# Altium project DRIVER POWER SUPPLY MODULE.PrjPcb
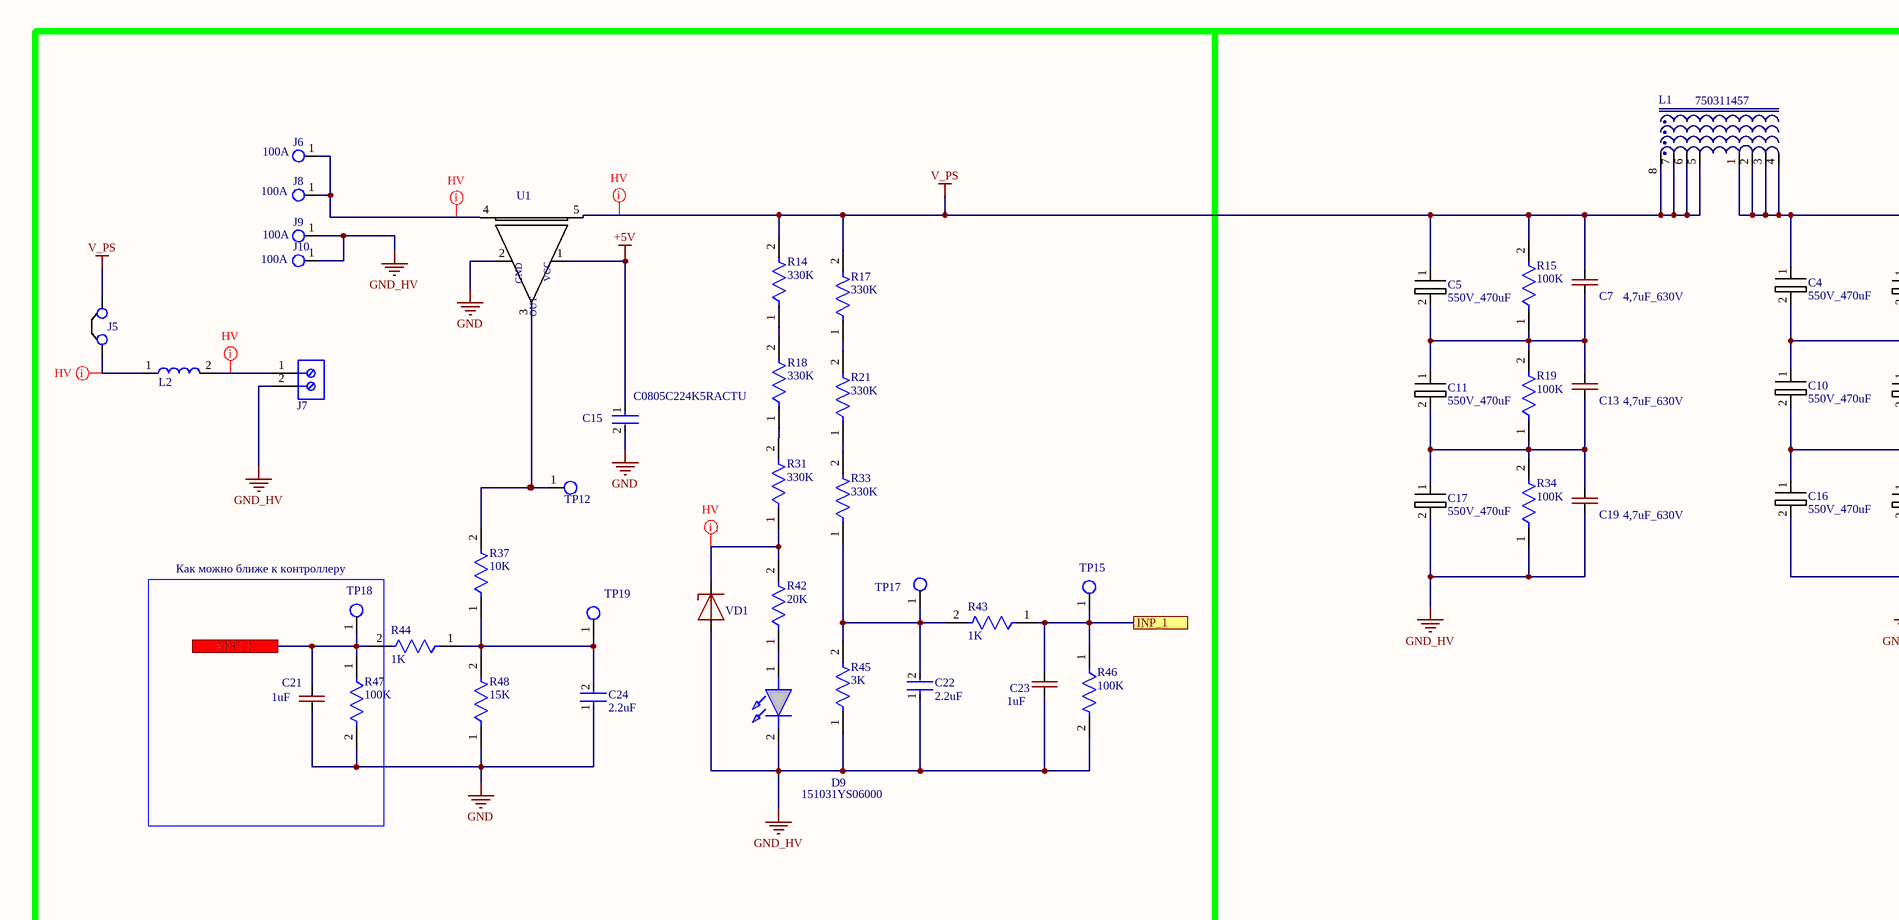
[diagram p0: DRIVER POWER SUPPLY MODULE.SchDoc, top left]
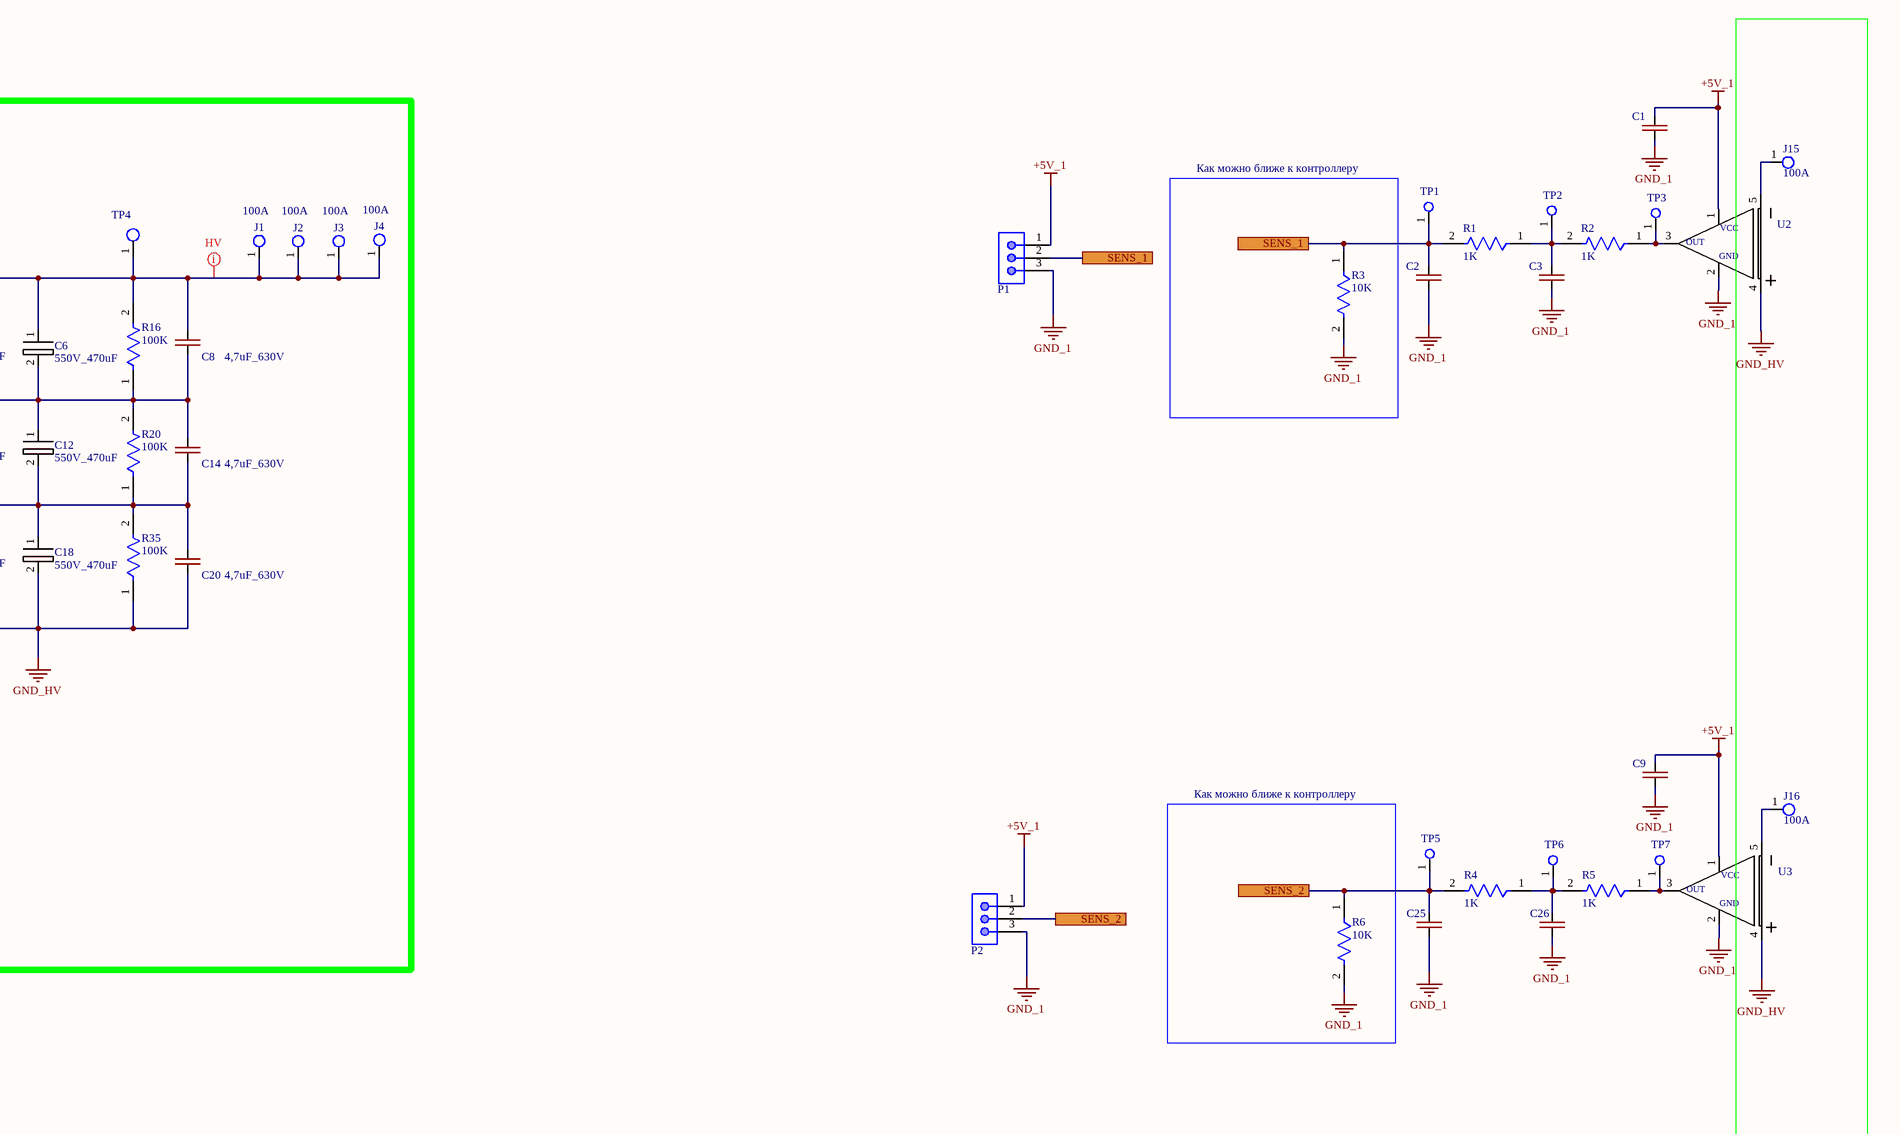
[diagram p1: DRIVER POWER SUPPLY MODULE.SchDoc, top right]
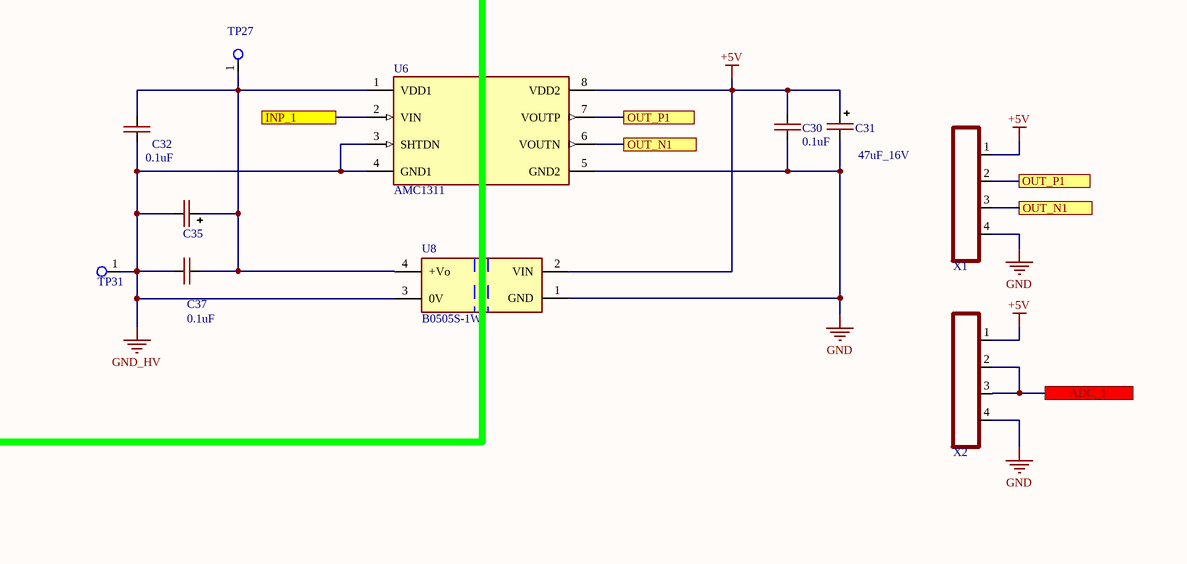
[diagram p2: DRIVER POWER SUPPLY MODULE.SchDoc, bottom left]
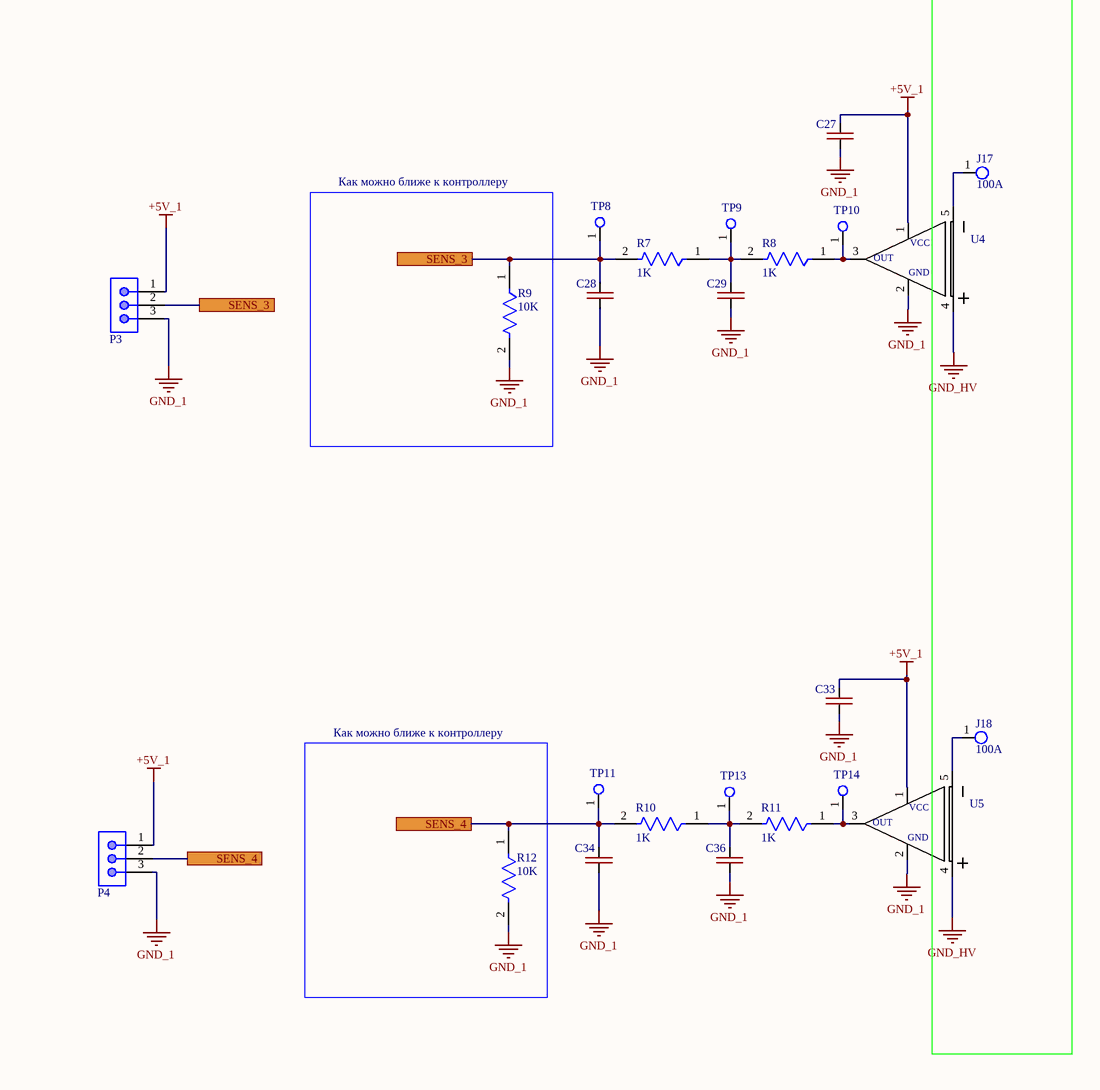
[diagram p3: DRIVER POWER SUPPLY MODULE.SchDoc, bottom right]
1 sheet, 120 parts. Net scope: flat (ports and power ports of the same name join across sheets).
Board file: DRIVER POWER SUPPLY MODULE.PcbDoc

## Sheet DRIVER POWER SUPPLY MODULE.SchDoc
size 1600 x 1200 mm; SheetNumber: 1; SheetTotal: 1; SPICEModelCacheBTRAQOWF: <root> / <DocumentId>BTRAQOWF</DocumentId> / </root>

### Parts
C1  CAP-NON-POLAR  [CAP-0805]  (value not drawn)
C2  CAP-NON-POLAR  [CAP-0805]  (value not drawn)
C3  CAP-NON-POLAR  [CAP-0805]  (value not drawn)
C4  550V_470uF  [500V_470uF]
C5  550V_470uF  [500V_470uF]
C6  550V_470uF  [500V_470uF]
C7  4,7uF_630V  [CAP_4.7uF_630V]
C8  4,7uF_630V  [CAP_4.7uF_630V]
C9  CAP-NON-POLAR  [CAP-0805]  (value not drawn)
C10  550V_470uF  [500V_470uF]
C11  550V_470uF  [500V_470uF]
C12  550V_470uF  [500V_470uF]
C13  4,7uF_630V  [CAP_4.7uF_630V]
C14  4,7uF_630V  [CAP_4.7uF_630V]
C15  C0805C224K5RACTU  [FP-C0805C-DN-MFG]
C16  550V_470uF  [500V_470uF]
C17  550V_470uF  [500V_470uF]
C18  550V_470uF  [500V_470uF]
C19  4,7uF_630V  [CAP_4.7uF_630V]
C20  4,7uF_630V  [CAP_4.7uF_630V]
C21  1uF  [CAP-0805]
C22  2.2uF  [FP-C0805C-DN-MFG]
C23  1uF  [CAP-0805]
C24  2.2uF  [FP-C0805C-DN-MFG]
C25  CAP-NON-POLAR  [CAP-0805]  (value not drawn)
C26  CAP-NON-POLAR  [CAP-0805]  (value not drawn)
C27  CAP-NON-POLAR  [CAP-0805]  (value not drawn)
C28  CAP-NON-POLAR  [CAP-0805]  (value not drawn)
C29  CAP-NON-POLAR  [CAP-0805]  (value not drawn)
C30  0.1uF  [CAP-0805]
C31  47uF_16V  [CAP-TAN-D]
C32  0.1uF  [CAP-0805]
C33  CAP-NON-POLAR  [CAP-0805]  (value not drawn)
C34  CAP-NON-POLAR  [CAP-0805]  (value not drawn)
C35  CAP-POLAR  [CAP-TAN-D]  (value not drawn)
C36  CAP-NON-POLAR  [CAP-0805]  (value not drawn)
C37  0.1uF  [CAP-0805]
D9  151031YS06000  [LED_RED]
J1  100A  [Klema_100A]
J2  100A  [Klema_100A]
J3  100A  [Klema_100A]
J4  100A  [Klema_100A]
J5  Jumper 1x2.54  [Jumper_2.54]  (value not drawn)
J6  100A  [Klema_100A]
J7  691101710002  [691101710002]  (value not drawn)
J8  100A  [Klema_100A]
J9  100A  [Klema_100A]
J10  100A  [Klema_100A]
J15  100A  [Klema_100A]
J16  100A  [Klema_100A]
J17  100A  [Klema_100A]
J18  100A  [Klema_100A]
L1  750311457  [Drossel]
L2  Coil  [Coil_drosel]  (value not drawn)
P1  61900311121  [61900311121]  (value not drawn)
P2  61900311121  [61900311121]  (value not drawn)
P3  61900311121  [61900311121]  (value not drawn)
P4  61900311121  [61900311121]  (value not drawn)
R1  1K  [RES-0805]
R2  1K  [RES-0805]
R3  10K  [RES-0805]
R4  1K  [RES-0805]
R5  1K  [RES-0805]
R6  10K  [RES-0805]
R7  1K  [RES-0805]
R8  1K  [RES-0805]
R9  10K  [RES-0805]
R10  1K  [RES-0805]
R11  1K  [RES-0805]
R12  10K  [RES-0805]
R14  330K  [RES-2512]
R15  100K  [RES-2W]
R16  100K  [RES-2W]
R17  330K  [RES-2512]
R18  330K  [RES-2512]
R19  100K  [RES-2W]
R20  100K  [RES-2W]
R21  330K  [RES-2512]
R31  330K  [RES-2512]
R33  330K  [RES-2512]
R34  100K  [RES-2W]
R35  100K  [RES-2W]
R37  10K  [RES-0805]
R42  20K  [RES-0805]
R43  1K  [RES-0805]
R44  1K  [RES-0805]
R45  3K  [RES-2512]
R46  100K  [RES-0805]
R47  100K  [RES-0805]
R48  15K  [RES-0805]
TP1  Test_Point_PCB  [Test_Point]  (value not drawn)
TP2  Test_Point_PCB  [Test_Point]  (value not drawn)
TP3  Test_Point_PCB  [Test_Point]  (value not drawn)
TP4  Test_Point_PCB  [Test_Point]  (value not drawn)
TP5  Test_Point_PCB  [Test_Point]  (value not drawn)
TP6  Test_Point_PCB  [Test_Point]  (value not drawn)
TP7  Test_Point_PCB  [Test_Point]  (value not drawn)
TP8  Test_Point_PCB  [Test_Point]  (value not drawn)
TP9  Test_Point_PCB  [Test_Point]  (value not drawn)
TP10  Test_Point_PCB  [Test_Point]  (value not drawn)
TP11  Test_Point_PCB  [Test_Point]  (value not drawn)
TP12  Test_Point_PCB  [Test_Point]  (value not drawn)
TP13  Test_Point_PCB  [Test_Point]  (value not drawn)
TP14  Test_Point_PCB  [Test_Point]  (value not drawn)
TP15  (no value)  [Test_Point]
TP17  Test_Point_PCB  [Test_Point]  (value not drawn)
TP18  (no value)  [Test_Point]
TP19  Test_Point_PCB  [Test_Point]  (value not drawn)
TP27  Test_Point_PCB  [Test_Point]  (value not drawn)
TP31  Test_Point_PCB  [Test_Point]  (value not drawn)
U1  (no value)  [ACS758-100]
U2  ACS758  [ACS758-100]  (value not drawn)
U3  ACS758  [ACS758-100]  (value not drawn)
U4  ACS758  [ACS758-100]  (value not drawn)
U5  ACS758  [ACS758-100]  (value not drawn)
U6  AMC1311  [FP-DWV0008A-MFG]
U8  B0505S-1W  [B0505S-1W]
VD1  (no value)  [DO-017AA]
X1  CONN-4-PIN  [CONN-PLS-4-2.54mm]  (value not drawn)
X2  CONN-4-PIN  [CONN-PLS-4-2.54mm]  (value not drawn)

### Blocks framed on the sheet
Как можно ближе к контроллеру: R3
Как можно ближе к контроллеру: C21 R47 TP18
Как можно ближе к контроллеру: R6
Как можно ближе к контроллеру: R9
Как можно ближе к контроллеру: R12

### Ports
ADC_1, INP_1, OUT_N1, OUT_P1, SENS_1, SENS_2, SENS_3, SENS_4

### Nets
+5V: C15.1 C30.1 C31.1(+) U1.1(+VCC) U6.8(VDD2) U8.2(VIN) X1.1 X2.1
+5V_1: C1.2 C9.2 C27.2 C33.2 P1.1 P2.1 P3.1 P4.1 U2.1(+VCC) U3.1(+VCC) U4.1(+VCC) U5.1(+VCC)
GND: C15.2 C21.1 C24.1 C30.2 C31.2(-) R47.2 R48.1 U1.2(GND) U6.5(GND2) U8.1(GND) X1.4 X2.4
GND_1: C1.1 C2.1 C3.1 C9.1 C25.1 C26.1 C27.1 C28.1 C29.1 C33.1 C34.1 C36.1 P1.3 P2.3 P3.3 P4.3 R3.2 R6.2 R9.2 R12.2 U2.2(GND) U3.2(GND) U4.2(GND) U5.2(GND)
GND_HV: C16.2 C17.2 C18.2 C19.1 C20.1 C22.1 C23.1 C32.1 C35.2(-) C37.2 D9.2(K) J7.2 J9.1 J10.1 R34.1 R35.1 R45.1 R46.2 TP31.1(G9) U2.4(+IP) U3.4(+IP) U4.4(+IP) U5.4(+IP) U6.3(SHTDN) U6.4(GND1) U8.3(0V) VD1.2(A)
V_PS: C5.1 C7.2 J5.2 L1.5 L1.6 L1.7 L1.8 R14.2 R15.2 R17.2 U1.5(-IP)
NetC2_2: C2.2 P1.2 R1.2 R3.1 TP1.1(G9) ; port SENS_1
NetC3_2: C3.2 R1.1 R2.2 TP2.1(G9)
NetC4_1: C4.1 C6.1 C8.2 J1.1 J2.1 J3.1 J4.1 L1.1 L1.2 L1.3 L1.4 R16.2 TP4.1(G9)
NetC4_2: C4.2 C6.2 C8.1 C10.1 C12.1 C14.2 R16.1 R20.2
NetC5_2: C5.2 C7.1 C11.1 C13.2 R15.1 R19.2
NetC10_2: C10.2 C12.2 C14.1 C16.1 C18.1 C20.2 R20.1 R35.2
NetC11_2: C11.2 C13.1 C17.1 C19.2 R19.1 R34.2
NetC21_2: C21.2 R44.2 R47.1 TP18.1(G9) X2.2 X2.3 ; port ADC_1
NetC22_2: C22.2 R33.1 R43.2 R45.2 TP17.1(G9)
NetC23_2: C23.2 R43.1 R46.1 TP15.1(G9) U6.2(VIN) ; port INP_1
NetC24_2: C24.2 R37.1 R44.1 R48.2 TP19.1(G9)
NetC25_2: C25.2 P2.2 R4.2 R6.1 TP5.1(G9) ; port SENS_2
NetC26_2: C26.2 R4.1 R5.2 TP6.1(G9)
NetC28_2: C28.2 P3.2 R7.2 R9.1 TP8.1(G9) ; port SENS_3
NetC29_2: C29.2 R7.1 R8.2 TP9.1(G9)
NetC32_2: C32.2 C35.1(+) C37.1 TP27.1(G9) U6.1(VDD1) U8.4(+Vo)
NetC34_2: C34.2 P4.2 R10.2 R12.1 TP11.1(G9) ; port SENS_4
NetC36_2: C36.2 R10.1 R11.2 TP13.1(G9)
NetD9_1: D9.1(A) R42.1
NetJ5_1: J5.1 L2.1
NetJ6_1: J6.1 J8.1 U1.4(+IP)
NetJ7_1: J7.1 L2.2
NetJ15_1: J15.1 U2.5(-IP)
NetJ16_1: J16.1 U3.5(-IP)
NetJ17_1: J17.1 U4.5(-IP)
NetJ18_1: J18.1 U5.5(-IP)
NetR2_1: R2.1 TP3.1(G9) U2.3(OUT)
NetR5_1: R5.1 TP7.1(G9) U3.3(OUT)
NetR8_1: R8.1 TP10.1(G9) U4.3(OUT)
NetR11_1: R11.1 TP14.1(G9) U5.3(OUT)
NetR14_1: R14.1 R18.2
NetR17_1: R17.1 R21.2
NetR18_1: R18.1 R31.2
NetR21_1: R21.1 R33.2
NetR31_1: R31.1 R42.2 VD1.1(C)
NetR37_2: R37.2 TP12.1(G9) U1.3(OUT)
NetU6_6: U6.6(VOUTN) X1.3 ; port OUT_N1
NetU6_7: U6.7(VOUTP) X1.2 ; port OUT_P1

### Layout directives
net class HV: NetC4_1, NetJ5_1, NetJ6_1, NetJ7_1, NetR31_1, V_PS

### Notes on the sheet
- (in symbol ACS758) VCC

### Library data of the parts
C4-C6 C10-C12 C16-C18 = CAP_POL_LOW_IMP
C7 C8 C13 C14 C19-C21 C23 C30 C32 C37 = CAP-NON-POLAR
C15 = CMP-1036-04552-2: CAP CER 0.22UF 50V X7R 0805; Manufacturer: KEMET; Value: 0.22 μF; Temperature Coefficient: 30ppm/°C; Material: Ceramic; Tolerance: 0.1; ComponentLink2URL: https://content.kemet.com/datasheets/KEM_C1003_C0G_SMD.pdf; Temperature Characteristic: X7R; Device Class L3: Ceramic Capacitors; Lead Free: Yes; Temperature: -55°C to +125°C; RoHS: TRUE; Capacitance: 0.22 μF; Automotive: No; Octopart: https://octopart.com/c0805c224k5ractu-kemet-144670; Manufacturer Part Number: C0805C224K5RACTU; Temperature Range Low: -55°C; Height: 0.88mm; Device Class L1: Passive Components; Digikey Description: CAP CER 0.22UF 50V X7R 0805; ComponentLink2Description: Datasheet; Mouser Description: CAP CER 0.22UF 50V X7R 0805; Category: Cap; Ipc Land Pattern Name: CAPC200125X78; Temperature Range High: +125°C; Package: C0805C-DN; Device Class L2: Capacitors; Voltage Rating: 50 V
C22 = CMP-1036-04552-2: CAP CER  2.2UF 50V X7R 0805; Manufacturer: KEMET; Manufacturer Part Number: C0805C224K5RACTU; Value: 0.22 μF; Temperature Coefficient: 30ppm/°C; Material: Ceramic; Tolerance: 0.1; ComponentLink2URL: https://content.kemet.com/datasheets/KEM_C1003_C0G_SMD.pdf; Temperature Characteristic: X7R; Device Class L3: Ceramic Capacitors; Lead Free: Yes; Temperature: -55°C to +125°C; RoHS: TRUE; Capacitance: 0.22 μF; Automotive: No; Octopart: https://octopart.com/c0805c224k5ractu-kemet-144670; Temperature Range Low: -55°C; Height: 0.88mm; Device Class L1: Passive Components; Digikey Description: CAP CER 0.22UF 50V X7R 0805; ComponentLink2Description: Datasheet; Mouser Description: CAP CER 0.22UF 50V X7R 0805; Category: Cap; Ipc Land Pattern Name: CAPC200125X78; Temperature Range High: +125°C; Package: C0805C-DN; Device Class L2: Capacitors; Voltage Rating: 50 V
C24 = CMP-1036-04552-2: CAP CER 2.2UF 50V X7R 0805; Manufacturer: KEMET; Manufacturer Part Number: C0805C224K5RACTU; Value: 0.22 μF; Temperature Coefficient: 30ppm/°C; Material: Ceramic; Tolerance: 0.1; ComponentLink2URL: https://content.kemet.com/datasheets/KEM_C1003_C0G_SMD.pdf; Temperature Characteristic: X7R; Device Class L3: Ceramic Capacitors; Lead Free: Yes; Temperature: -55°C to +125°C; RoHS: TRUE; Capacitance: 0.22 μF; Automotive: No; Octopart: https://octopart.com/c0805c224k5ractu-kemet-144670; Temperature Range Low: -55°C; Height: 0.88mm; Device Class L1: Passive Components; Digikey Description: CAP CER 0.22UF 50V X7R 0805; ComponentLink2Description: Datasheet; Mouser Description: CAP CER 0.22UF 50V X7R 0805; Category: Cap; Ipc Land Pattern Name: CAPC200125X78; Temperature Range High: +125°C; Package: C0805C-DN; Device Class L2: Capacitors; Voltage Rating: 50 V
C31 = CAP-POLAR
D9 = LED: WURTH ELEKTRONIK - 151031YS06000 - LED, Yellow, Through Hole, T-1 (3mm), 30 mA, 2 V, 590 nm; Geometry.Height: 5.5mm; Manufacturer_Name: Wurth Elektronik; Manufacturer_Part_Number: 151031YS06000; Mouser Part Number: 710-151031YS06000; Mouser Price/Stock: https://www.mouser.co.uk/ProductDetail/Wurth-Elektronik/151031YS06000?qs=LlUlMxKIyB3xSYYW%252BcuBiQ%3D%3D; Arrow Part Number: *; Arrow Price/Stock: *; Mouser Testing Part Number: *; Mouser Testing Price/Stock: *; Datasheet Link: https://katalog.we-online.de/led/datasheet/151031YS06000.pdf
J1-J4 J6 J8-J10 J15-J18 = Klema_15_A
J7 = 691101710002: WR-TBL Series 101 Horizontal Entry Modular, THT, pitch 5mm, 2p; Manufacturer: Wurth Elektronik; Modularity: Yes; Rated Current: 16A; Working Voltage: 250V; ComponentLink1Description: Website Link; ComponentLink1URL: https://www.we-online.com/redexpert/article/691101710002?ad; ComponentLink2Description: Datasheet Link; ComponentLink2URL: https://www.we-online.com/redexpert/spec/691101710002?ad; Manufacturer Part Number: 691101710002; Category: Terminal Blocks; Match Code: WR-TBL; Mount: Through Hole; Operating Temperature Max: 105°C; Operating Temperature Min: -40°C; Packaging: Box; Application: Pressure Clamp; Number of Pins: 2; Number of Rows: 1; Orientation: Horizontal; Pitch: 5mm
L1 = DROSEL: Manufacturer: Wuerth Elektronik; Ui: 36V; ComponentLink1Description: Manufacturer URL; ComponentLink2Description: Datasheet; ComponentLink1URL: http://www.we-online.com; PartNumber: 750311457; PackageReference: EP13; ComponentLink2URL: http://katalog.we-online.de/pbs/datasheet/750311457.pdf
P1-P4 = 61900311121: WR-WTB THT Male Vertical Locking Header, pitch 2.54mm, 3p; Pin Number: 3; Contact Resistance: 20mOhm; Rated Current: 3A; Withstanding Voltage: 1000VAC; Working Voltage: 250VAC; ComponentLink1Description: Manufacturer; ComponentLink1URL: http://www.we-online.de; ComponentLink2Description: Datasheet; ComponentLink2URL: https://www.we-online.com/catalog/datasheet/61900311121.pdf; Pitch: 2.54mm; Published Date: January 2020; Publisher: Wurth Elektronik; Mounting Technology: THT; Packaging: Bag; Operating Temperature: -40 to +105degC; Part Number: 61900311121; Gender: Male; Type: Vertical
R1-R12 R14-R21 R31 R33-R35 R37 R42-R48 = RES-CONST
TP1-TP15 TP17-TP19 TP27 TP31 = TP_PCB?: Test_Point
U1 = ACS758
VD1 = ZENER